# Altium schematic sheet PowerConnector.SchDoc
size Letter; CompanyName: Ploopy Co; Organization: Ploopy Co; Address1: 137-1140 Burnhamthorpe Road W; Address2: Mississauga; Address3: Ontario; Address4: Canada L5C 0A3; DocumentNumber: 4; Revision: R1.001; SheetNumber: 4; SheetTotal: 7
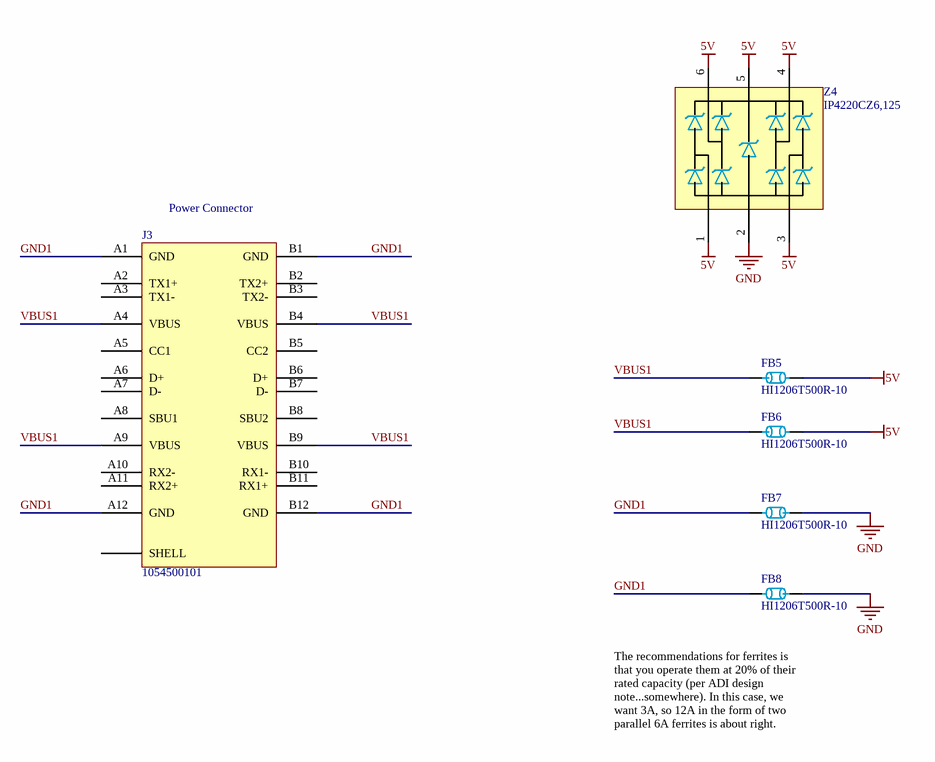
[diagram p0: PowerConnector.SchDoc]

## Parts
FB5  HI1206T500R-10  [1206]
FB6  HI1206T500R-10  [1206]
FB7  HI1206T500R-10  [1206]
FB8  HI1206T500R-10  [1206]
J3  1054500101  [1054500101]
Z4  IP4220CZ6,125  [PESD3V3S4UD - SOT95P275X110-6N]

## Nets
5V: FB5.2 FB6.2 Z4.1 Z4.3 Z4.4 Z4.5 Z4.6
GND: FB7.1 FB8.1 Z4.2
GND1: FB7.2 FB8.2 J3.A1(GND) J3.A12(GND) J3.B1(GND) J3.B12(GND)
VBUS1: FB5.1 FB6.1 J3.A4(VBUS) J3.A9(VBUS) J3.B4(VBUS) J3.B9(VBUS)

Not connected (* = marked no-connect by the designer): J3 A2(TX1+) A3(TX1-) A5(CC1) A6(D+) A7(D-) A8(SBU1) A10(RX2-) A11(RX2+) B2(TX2+) B3(TX2-) B5(CC2) B6(D+) B7(D-) B8(SBU2) B10(RX1-) B11(RX1+) SHELL

## Notes on the sheet
- (near J3) Power Connector
- The recommendations for ferrites is that you operate them at 20% of their rated capacity (per ADI design note...somewhere). In this case, we want 3A, so 12A in the form of two parallel 6A ferrites is about right.
- Copyright Ploopy Corporation 2020
- Licensed under the CERN OHL v. 1.2
- http://ohwr.org/cernohl
- Title:
- PCB:
- Version:
- Ploopy Corporation
- Mississauga ON L5C 0A3
- 137-1140 Burnhamthorpe Road W
- Date:
- Time:
- Sheet
- of
- Canada

## Library data of the parts
FB5-FB8 = HI1206T500R-10: 50 Ohms @ 100MHz 1 Power, Signal Line Ferrite Bead 1206 (3216 Metric) 6A 10mOhm; Value: Ferrite Bead 50R 6A; Supplier 1: Digi-Key; Supplier 2: Mouser; Supplier Part Number 1: 240-2412-1-ND; Supplier Part Number 2: 875-HI1206T500R-10
J3 = 1054500101: USB - C (Type - C) USB 3.1 (USB 3.1 Gen 2, Superspeed+) Receptacle Connector 24 Position Surface Mount, Right Angle; Through Hole; Supplier 1: Digi-Key; Supplier 2: Arrow; Supplier Part Number 2: 105450-0101; Supplier Part Number 1: WM12856CT-ND
Z4 = IP4220CZ6,125: TVS DIODE 5.5V 6TSOP (Low capacitance, USB); Supplier 1: Digi-Key; Supplier 2: Mouser; Supplier 3: Arrow; Supplier Part Number 1: 1727-3578-1-ND; Supplier Part Number 2: 771-IP4220CZ6-T/R; Supplier Part Number 3: IP4220CZ6,125